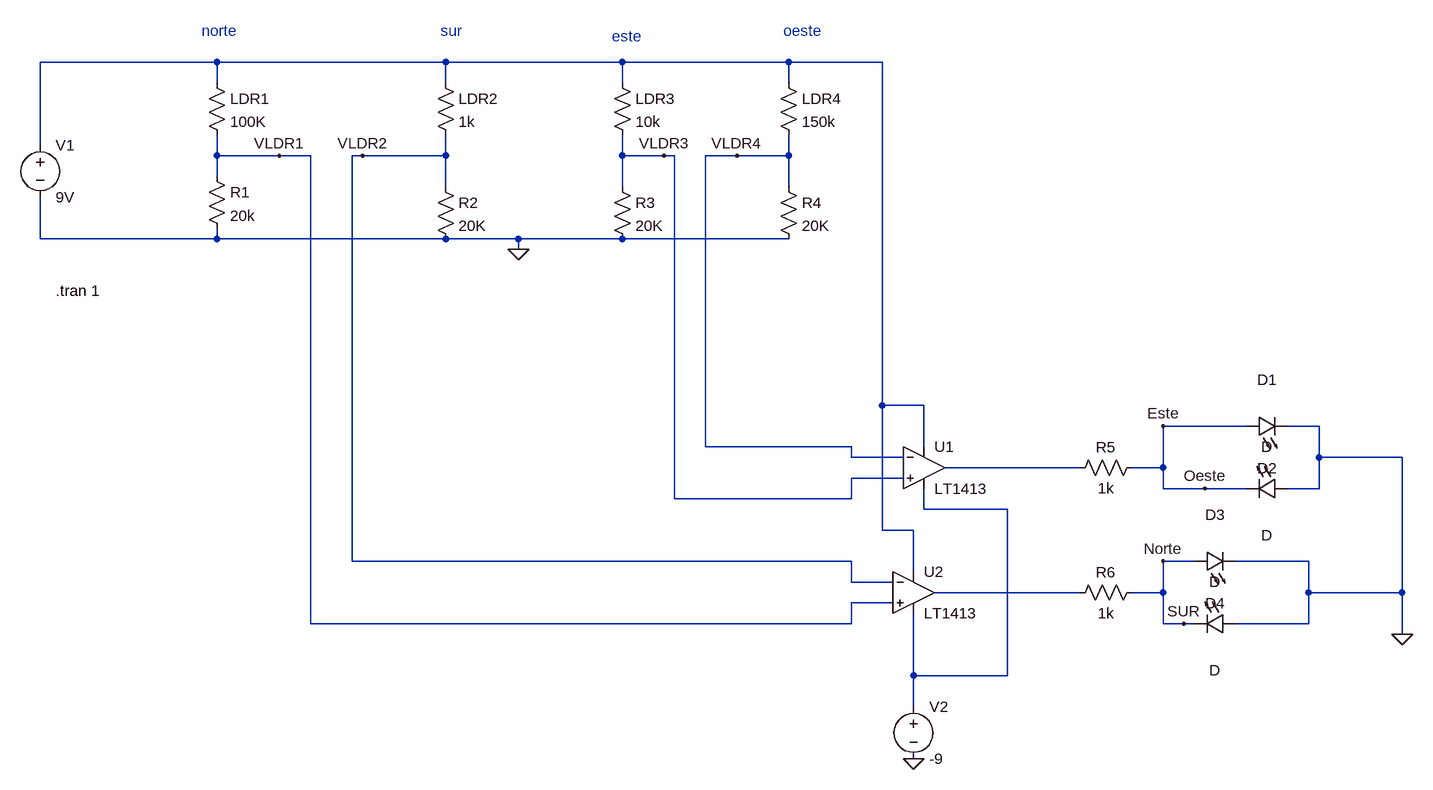
[diagram p0: schematic Draft1.asc]
Draft1.asc, the LTspice schematic file:
Version 4
SHEET 1 1988 768
WIRE 144 -400 -128 -400
WIRE 496 -400 144 -400
WIRE 768 -400 496 -400
WIRE 1024 -400 768 -400
WIRE 1168 -400 1024 -400
WIRE 144 -368 144 -400
WIRE 496 -368 496 -400
WIRE 768 -368 768 -400
WIRE 1024 -368 1024 -400
WIRE -128 -272 -128 -400
WIRE 144 -256 144 -288
WIRE 240 -256 144 -256
WIRE 288 -256 240 -256
WIRE 368 -256 352 -256
WIRE 496 -256 496 -288
WIRE 496 -256 368 -256
WIRE 768 -256 768 -288
WIRE 832 -256 768 -256
WIRE 848 -256 832 -256
WIRE 944 -256 896 -256
WIRE 1024 -256 1024 -288
WIRE 1024 -256 944 -256
WIRE 144 -224 144 -256
WIRE 496 -208 496 -256
WIRE 768 -208 768 -256
WIRE 1024 -208 1024 -256
WIRE -128 -128 -128 -192
WIRE 144 -128 144 -144
WIRE 144 -128 -128 -128
WIRE 496 -128 144 -128
WIRE 608 -128 496 -128
WIRE 768 -128 608 -128
WIRE 1024 -128 768 -128
WIRE 608 -112 608 -128
WIRE 1168 128 1168 -400
WIRE 1232 128 1168 128
WIRE 1728 160 1600 160
WIRE 1840 160 1792 160
WIRE 896 192 896 -256
WIRE 1120 192 896 192
WIRE 1232 192 1232 128
WIRE 1120 208 1120 192
WIRE 1200 208 1120 208
WIRE 1840 208 1840 160
WIRE 1968 208 1840 208
WIRE 1472 224 1264 224
WIRE 1600 224 1600 160
WIRE 1600 224 1552 224
WIRE 1200 240 1120 240
WIRE 1600 256 1600 224
WIRE 1664 256 1600 256
WIRE 1728 256 1664 256
WIRE 1840 256 1840 208
WIRE 1840 256 1792 256
WIRE 848 272 848 -256
WIRE 1120 272 1120 240
WIRE 1120 272 848 272
WIRE 1232 288 1232 256
WIRE 1360 288 1232 288
WIRE 1168 320 1168 128
WIRE 1216 320 1168 320
WIRE 352 368 352 -256
WIRE 1120 368 352 368
WIRE 1648 368 1600 368
WIRE 1824 368 1712 368
WIRE 1216 384 1216 320
WIRE 1120 400 1120 368
WIRE 1184 400 1120 400
WIRE 1472 416 1248 416
WIRE 1600 416 1600 368
WIRE 1600 416 1552 416
WIRE 1824 416 1824 368
WIRE 1968 416 1968 208
WIRE 1968 416 1824 416
WIRE 1184 432 1120 432
WIRE 288 464 288 -256
WIRE 1120 464 1120 432
WIRE 1120 464 288 464
WIRE 1600 464 1600 416
WIRE 1632 464 1600 464
WIRE 1648 464 1632 464
WIRE 1824 464 1824 416
WIRE 1824 464 1712 464
WIRE 1968 480 1968 416
WIRE 1216 544 1216 448
WIRE 1360 544 1360 288
WIRE 1360 544 1216 544
WIRE 1216 592 1216 544
FLAG 608 -112 0
FLAG 240 -256 VLDR1
FLAG 368 -256 VLDR2
FLAG 832 -256 VLDR3
FLAG 944 -256 VLDR4
FLAG 1968 480 0
FLAG 1216 672 0
FLAG 1632 464 SUR
FLAG 1600 368 Norte
FLAG 1600 160 Este
FLAG 1664 256 Oeste
SYMBOL voltage -128 -288 R0
WINDOW 123 0 0 Left 0
WINDOW 39 0 0 Left 0
SYMATTR InstName V1
SYMATTR Value 9V
SYMBOL res 128 -384 R0
SYMATTR InstName LDR1
SYMATTR Value 100K
SYMBOL res 128 -240 R0
SYMATTR InstName R1
SYMATTR Value 20k
SYMBOL res 480 -224 R0
SYMATTR InstName R2
SYMATTR Value 20K
SYMBOL res 480 -384 R0
SYMATTR InstName LDR2
SYMATTR Value 1k
SYMBOL res 752 -384 R0
SYMATTR InstName LDR3
SYMATTR Value 10k
SYMBOL res 752 -224 R0
SYMATTR InstName R3
SYMATTR Value 20K
SYMBOL res 1008 -224 R0
SYMATTR InstName R4
SYMATTR Value 20K
SYMBOL res 1008 -384 R0
SYMATTR InstName LDR4
SYMATTR Value 150k
SYMBOL voltage 1216 576 R0
WINDOW 123 0 0 Left 0
WINDOW 39 0 0 Left 0
SYMATTR InstName V2
SYMATTR Value -9
SYMBOL OpAmps\\LT1413 1232 160 R0
SYMATTR InstName U1
SYMBOL OpAmps\\LT1413 1216 352 R0
SYMATTR InstName U2
SYMBOL res 1568 208 R90
WINDOW 0 0 56 VBottom 2
WINDOW 3 32 56 VTop 2
SYMATTR InstName R5
SYMATTR Value 1k
SYMBOL res 1568 400 R90
WINDOW 0 0 56 VBottom 2
WINDOW 3 32 56 VTop 2
SYMATTR InstName R6
SYMATTR Value 1k
SYMBOL LED 1728 176 R270
WINDOW 0 72 32 VTop 2
WINDOW 3 0 32 VBottom 2
SYMATTR InstName D1
SYMBOL LED 1792 240 R90
WINDOW 0 0 32 VBottom 2
WINDOW 3 72 32 VTop 2
SYMATTR InstName D2
SYMBOL LED 1648 384 R270
WINDOW 0 72 32 VTop 2
WINDOW 3 0 32 VBottom 2
SYMATTR InstName D3
SYMBOL LED 1712 448 R90
WINDOW 0 0 32 VBottom 2
WINDOW 3 72 32 VTop 2
SYMATTR InstName D4
TEXT -104 -48 Left 2 !.tran 1
TEXT 120 -448 Left 2 ;norte
TEXT 488 -448 Left 2 ;sur
TEXT 752 -440 Left 2 ;este
TEXT 1016 -448 Left 2 ;oeste

The netlist it stands for:
* Draft1.asc
V1 N001 0 9V
R§LDR1 N001 VLDR1 100K
R1 VLDR1 0 20k
R2 VLDR2 0 20K
R§LDR2 N001 VLDR2 1k
R§LDR3 N001 VLDR3 10k
R3 VLDR3 0 20K
R4 VLDR4 0 20K
R§LDR4 N001 VLDR4 150k
V2 N003 0 -9
XU1 VLDR3 VLDR4 N001 N003 N002 LT1413  ; pins In+ In- V+ V- OUT
XU2 VLDR1 VLDR2 N001 N003 N004 LT1413  ; pins In+ In- V+ V- OUT
R5 Oeste N002 1k
R6 Norte N004 1k
D1 Oeste 0 D
D2 0 Oeste D
D3 Norte 0 D
D4 0 Norte D
.model D D
.lib standard.dio
.tran 1
* norte
* sur
* este
* oeste
.lib LTC.lib
.backanno
.end